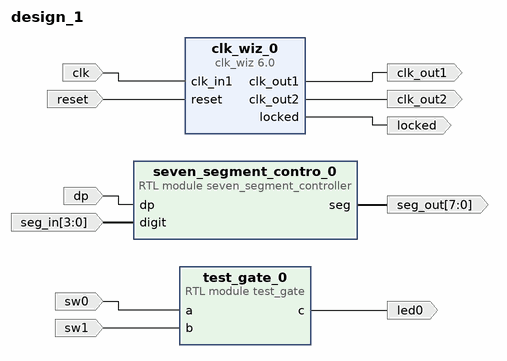
[diagram p0: block diagram of the top level]
# Vivado block design design_1, xc7a35tcpg236-1, Vivado 2022.2
create_bd_design design_1

create_bd_port -dir I reset
create_bd_port -dir I clk
create_bd_port -dir O clk_out1
create_bd_port -dir O locked
create_bd_port -dir I -from 3 -to 0 seg_in
create_bd_port -dir O -from 7 -to 0 seg_out
create_bd_port -dir I sw1
create_bd_port -dir I sw0
create_bd_port -dir O led0
create_bd_port -dir O clk_out2
create_bd_port -dir I dp

create_bd_cell -type ip -vlnv xilinx.com:ip:clk_wiz:6.0 clk_wiz_0
set_property -dict [list \
  CONFIG.CLKOUT2_JITTER 130.958 \
  CONFIG.CLKOUT2_PHASE_ERROR 98.575 \
  CONFIG.CLKOUT2_USED true \
  CONFIG.MMCM_CLKOUT1_DIVIDE 10 \
  CONFIG.NUM_OUT_CLKS 2 \
] [get_bd_cells clk_wiz_0]
create_bd_cell -type module -reference test_gate test_gate_0
create_bd_cell -type module -reference seven_segment_controller seven_segment_contro_0

# ---- connections ----

connect_bd_net [get_bd_ports clk] [get_bd_pins clk_wiz_0/clk_in1]
connect_bd_net [get_bd_pins clk_wiz_0/clk_out1] [get_bd_ports clk_out1]
connect_bd_net [get_bd_pins clk_wiz_0/clk_out2] [get_bd_ports clk_out2]
connect_bd_net [get_bd_pins clk_wiz_0/locked] [get_bd_ports locked]
connect_bd_net [get_bd_ports dp] [get_bd_pins seven_segment_contro_0/dp]
connect_bd_net [get_bd_ports reset] [get_bd_pins clk_wiz_0/reset]
connect_bd_net [get_bd_ports seg_in] [get_bd_pins seven_segment_contro_0/digit]
connect_bd_net [get_bd_pins seven_segment_contro_0/seg] [get_bd_ports seg_out]
connect_bd_net -net sw0_1 [get_bd_ports sw0] [get_bd_pins test_gate_0/a]
connect_bd_net -net sw1_1 [get_bd_ports sw1] [get_bd_pins test_gate_0/b]
connect_bd_net [get_bd_pins test_gate_0/c] [get_bd_ports led0]

validate_bd_design
save_bd_design
